# EAGLE design ButtonLatencyTester2 (EAGLE 7.7.0)
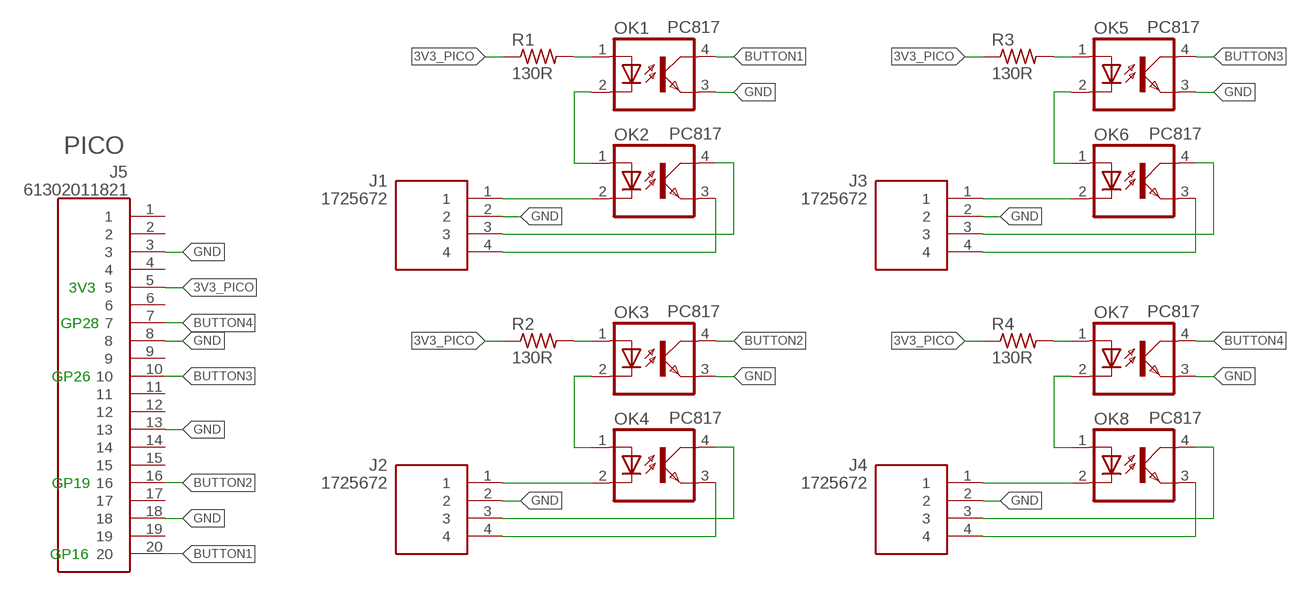
[diagram p0: schematic, sheet 1]

## Parts
J1  1725672  [1725672-4-2.54]
J2  1725672  [1725672-4-2.54]
J3  1725672  [1725672-4-2.54]
J4  1725672  [1725672-4-2.54]
J5  61302011821  [RHDR20W60P0X254_1X20_5130X250X]
OK1  PC817  [DIL04]
OK2  PC817  [DIL04]
OK3  PC817  [DIL04]
OK4  PC817  [DIL04]
OK5  PC817  [DIL04]
OK6  PC817  [DIL04]
OK7  PC817  [DIL04]
OK8  PC817  [DIL04]
R1  130R  R-US_0204/7  [0204/7]
R2  130R  R-US_0204/7  [0204/7]
R3  130R  R-US_0204/7  [0204/7]
R4  130R  R-US_0204/7  [0204/7]

## Nets
3V3_PICO: J5.5 R1.1 R2.1 R3.1 R4.1
BUTTON1: J5.20 OK1.4(COL)
BUTTON2: J5.16 OK3.4(COL)
BUTTON3: J5.10 OK5.4(COL)
BUTTON4: J5.7 OK7.4(COL)
GND: J1.2 J2.2 J3.2 J4.2 J5.3 J5.8 J5.13 J5.18 OK1.3(EMIT) OK3.3(EMIT) OK5.3(EMIT) OK7.3(EMIT)
N$1: OK1.1(A) R1.2
N$2: OK3.1(A) R2.2
N$3: OK1.2(C) OK2.1(A)
N$4: J1.4 OK2.3(EMIT)
N$5: J1.1 OK2.2(C)
N$6: J1.3 OK2.4(COL)
N$7: OK3.2(C) OK4.1(A)
N$8: J2.1 OK4.2(C)
N$9: J2.4 OK4.3(EMIT)
N$10: J2.3 OK4.4(COL)
N$11: OK5.1(A) R3.2
N$12: OK5.2(C) OK6.1(A)
N$13: J3.1 OK6.2(C)
N$14: J3.4 OK6.3(EMIT)
N$15: J3.3 OK6.4(COL)
N$16: OK7.1(A) R4.2
N$17: OK7.2(C) OK8.1(A)
N$18: J4.1 OK8.2(C)
N$19: J4.4 OK8.3(EMIT)
N$20: J4.3 OK8.4(COL)
Unconnected: J5.1 J5.2 J5.4 J5.6 J5.9 J5.11 J5.12 J5.14 J5.15 J5.17 J5.19

## Notes on the sheet
- PICO
- 3V3
- GP28
- GP26
- GP19
- GP16

## Library data of the parts
J1-J4 = SamacSys_Parts:1725672: 4 way vertical PCB terminal,6A 63V Phoenix Contact Non-Fused Terminal Block, 4 Way, Solder Terminals, 26 ??? 20 AWG Through Hole, Nylon, 63 V Source: Datasheet <https://www.phoenixcontact.com/online/portal/us?uri=pxc-oc-itemdetail:pid=1725672&library=usen&tab=1.pdf>; DESCRIPTION: 4 way vertical PCB terminal,6A 63V Phoenix Contact Non-Fused Terminal Block, 4 Way, Solder Terminals, 26 ??? 20 AWG Through Hole, Nylon, 63 V; HEIGHT: mm; MANUFACTURER_NAME: Phoenix Contact; MANUFACTURER_PART_NUMBER: 1725672; MOUSER_PART_NUMBER: 651-1725672; MOUSER_PRICE-STOCK: https://www.mouser.co.uk/ProductDetail/Phoenix-Contact/1725672/?qs=Ul7CXFMnlWXX93F9bOV2pQ%3D%3D
J5 = SamacSys_Parts:61302011821: WURTH ELEKTRONIK - 61302011821 - PCB Receptacle, Board-to-Board, 2.54 mm, 1 Rows, 20 Contacts, Through Hole Mount, WR-PHD Series Source: Datasheet <https://www.we-online.de/katalog/datasheet/6130xx11821.pdf>; DESCRIPTION: WURTH ELEKTRONIK - 61302011821 - PCB Receptacle, Board-to-Board, 2.54 mm, 1 Rows, 20 Contacts, Through Hole Mount, WR-PHD Series; HEIGHT: 8.65mm; MANUFACTURER_NAME: Wurth Elektronik; MANUFACTURER_PART_NUMBER: 61302011821; MOUSER_PART_NUMBER: 710-61302011821; MOUSER_PRICE-STOCK: https://www.mouser.co.uk/ProductDetail/Wurth-Elektronik/61302011821?qs=iLbezkQI%252Bsj8WCQQzMTU0A%3D%3D
OK1-OK8 = optocoupler:PC817: SHARP OPTO COUPLER; MPN: PC817X4J000F; OC_FARNELL: 9707727; OC_NEWARK: 97K7059
R1-R4 = resistor:R-US_: RESISTOR, American symbol

## Board
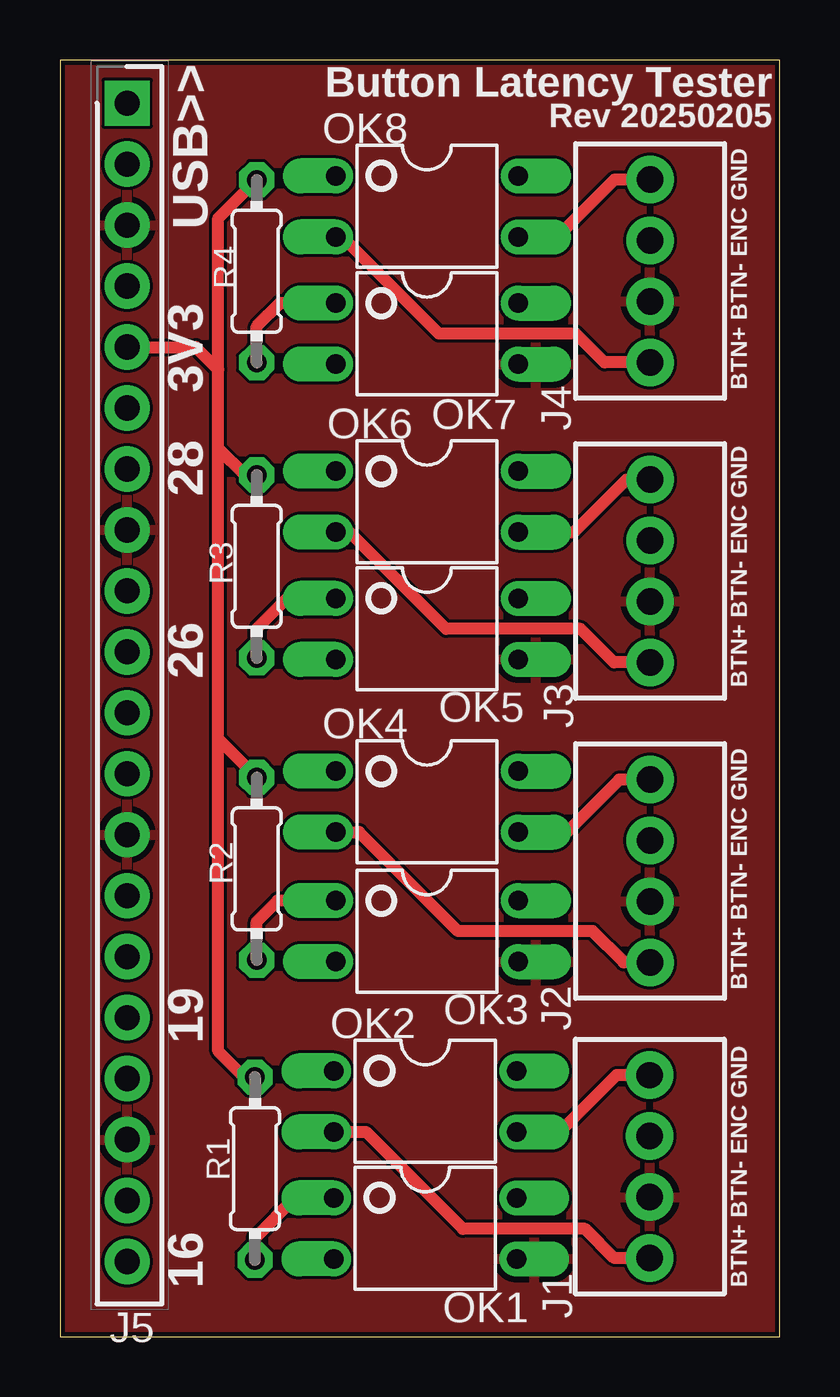
[diagram p1: board, top side]
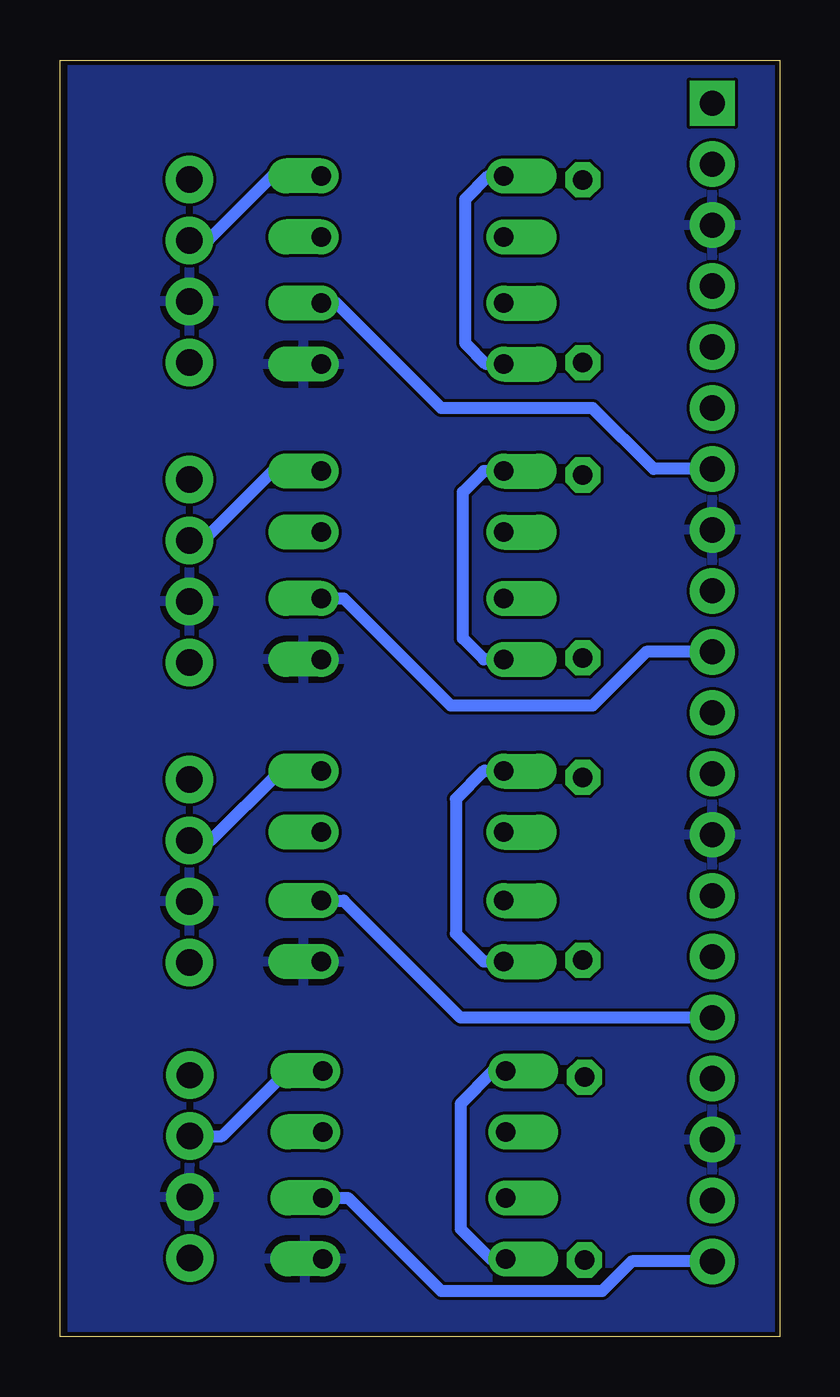
[diagram p2: board, bottom side, seen from below]

Size 30 x 53.2 mm. Coordinates in mm from the lower left corner, seen from the top.
Outline: 0,0 30,0 30,53.2 0,53.2 0,0
Copper layers (1*16): Top 0.035mm / dielectric 1.6mm / Bottom 0.035mm
Design rules "jlcpcb-2layers": minimum track width 5mil, minimum drill 0.3mm, track to track 5mil, track to pad 5mil, pad to pad 5mil, via to via 5mil, smd to smd 5mil, copper to edge 0.2mm, drill to drill 6mil, minimum pad ring 10mil, minimum via ring 3mil, stop-mask expansion 4mil, vias tented up to drill 0mil, thermal gap 10mil

### Footprints (pad centres in the part's own frame; a part is rotated, then mirrored left to right if it is on the bottom)
1725672-4-2.54 = drill 1.1 pad 1.65: 1 0,0; 2 2.54,0; 3 5.08,0; 4 7.62,0
RHDR20W60P0X254_1X20_5130X250X = drill 1.05 pad 1.575 square: 1 0,0 | drill 1.05 pad 1.575: 2 2.54,0; 3 5.08,0; 4 7.62,0; 5 10.16,0; 6 12.7,0; 7 15.24,0; 8 17.78,0; 9 20.32,0; 10 22.86,0; 11 25.4,0; 12 27.94,0; 13 30.48,0; 14 33.02,0; 15 35.56,0; 16 38.1,0; 17 40.64,0; 18 43.18,0; 19 45.72,0; 20 48.26,0
DIL04 = drill 0.813 offset: 1 -1.27,-3.81; 2 1.27,-3.81; 3 1.27,3.81; 4 -1.27,3.81
0204/7 = drill 0.813 octagon: 1 -3.81,0; 2 3.81,0

### Placement (x,y rotation side)
J1  24.59,3.28 90 top
J2  24.6,15.6 90 top
J3  24.6,28.1 90 top
J4  24.6,40.6 90 top
J5  2.8,51.4 270 top
OK1  15.23,4.52 270 top
OK2  15.23,9.81 270 top
OK3  15.3,16.9 270 top
OK4  15.3,22.3 270 top
OK5  15.3,29.5 270 top
OK6  15.3,34.8 270 top
OK7  15.3,41.8 270 top
OK8  15.3,47.1 270 top
R1  8.13,7.01 270 top
R2  8.2,19.5 270 top
R3  8.2,32.1 270 top
R4  8.2,44.4 270 top

### Tracks (layer width: path | path; a pad name or v marks a point on that pad's centre or on a via)
3V3_PICO
  Top 0.5: R1.1 7.68,10.82 6.6,11.9 6.6,24.91 | 6.6,24.91 6.6,37 | 6.6,24.91 R2.1 | R3.1 7.69,35.91 6.6,37 | 6.6,37 6.6,40.3 | 6.6,40.3 6.6,46.61 R4.1 | J5.5 5.66,41.24 6.6,40.3
BUTTON1
  Bottom 0.5: OK1.4 17.99,5.79 14.1,1.9 7.4,1.9 6.16,3.14 J5.20
BUTTON2
  Bottom 0.5: OK3.4 18.17,18.17 13.3,13.3 J5.16
BUTTON3
  Bottom 0.5: OK5.4 18.17,30.77 13.7,26.3 7.8,26.3 5.56,28.54 J5.10
BUTTON4
  Bottom 0.5: OK7.4 18.47,43.07 14.1,38.7 7.8,38.7 5.26,36.16 J5.7
GND
  pour Top: 0,53.3 30,53.3 30,-0.4 0,-0.4
  pour Bottom: 0.3,53.6 29.5,53.6 29.5,-0.1 0.3,-0.1
N$1
  Top 0.5: OK1.1 9.79,5.79 8.13,4.13 R1.2
N$2
  Top 0.5: OK3.1 9.07,18.17 8.2,17.3 R2.2
N$3
  Bottom 0.5: OK1.2 12.05,3.25 13.3,4.5 13.3,9.7 11.92,11.08 OK2.1
N$4
  Top 0.5: OK2.3 20.84,8.54 23.2,10.9 J1.4
N$5
  Top 0.5: J1.1 23.12,3.28 21.9,4.5 16.8,4.5 12.76,8.54 OK2.2
N$6
  Bottom 0.5: J1.3 23.24,8.36 20.52,11.08 OK2.4
N$7
  Bottom 0.5: OK3.2 12.33,15.63 13.5,16.8 13.5,22.4 12.3,23.6 12.27,23.57 OK4.1
N$8
  Top 0.5: J2.1 23.5,15.6 22.2,16.9 16.6,16.9 12.47,21.03 OK4.2
N$9
  Top 0.5: OK4.3 21.13,21.03 23.32,23.22 J2.4
N$10
  Bottom 0.5: J2.3 23.72,20.68 20.83,23.57 OK4.4
N$11
  Top 0.5: R3.2 8.2,29.5 9.47,30.77 OK5.1
N$12
  Bottom 0.5: OK5.2 12.33,28.23 13.2,29.1 13.2,35.2 12.33,36.07 OK6.1
N$13
  Top 0.5: J3.1 23.1,28.1 21.7,29.5 16.1,29.5 12.07,33.53 OK6.2
N$14
  Top 0.5: OK6.3 21.43,33.53 23.62,35.72 J3.4
N$15
  Bottom 0.5: OK6.4 21.13,36.07 24.02,33.18 J3.3
N$16
  Top 0.5: OK7.1 9.17,43.07 8.2,42.1 R4.2
N$17
  Bottom 0.5: OK7.2 12.23,40.53 13.1,41.4 13.1,47.4 12.13,48.37 OK8.1
N$18
  Top 0.5: J4.1 22.7,40.6 21.5,41.8 15.8,41.8 11.77,45.83 OK8.2
N$19
  Top 0.5: J4.4 23.12,48.22 20.73,45.83 OK8.3
N$20
  Bottom 0.5: J4.3 23.82,45.68 21.13,48.37 OK8.4

### Text on the board
tPlace: Button Latency Tester | Rev 20250205 | USB>> | BTN+ BTN- ENC GND | 3V3 | 28 | BTN+ BTN- ENC GND | 26 | BTN+ BTN- ENC GND | 19 | BTN+ BTN- ENC GND | 16